# Altium schematic sheet 01_BLOCK_DIAGRAM.SchDoc: Block diagram
size 420 x 297 mm; Author: T. Ludemann; SheetNumber: 1; SheetTotal: 8; DocSize: DINA3
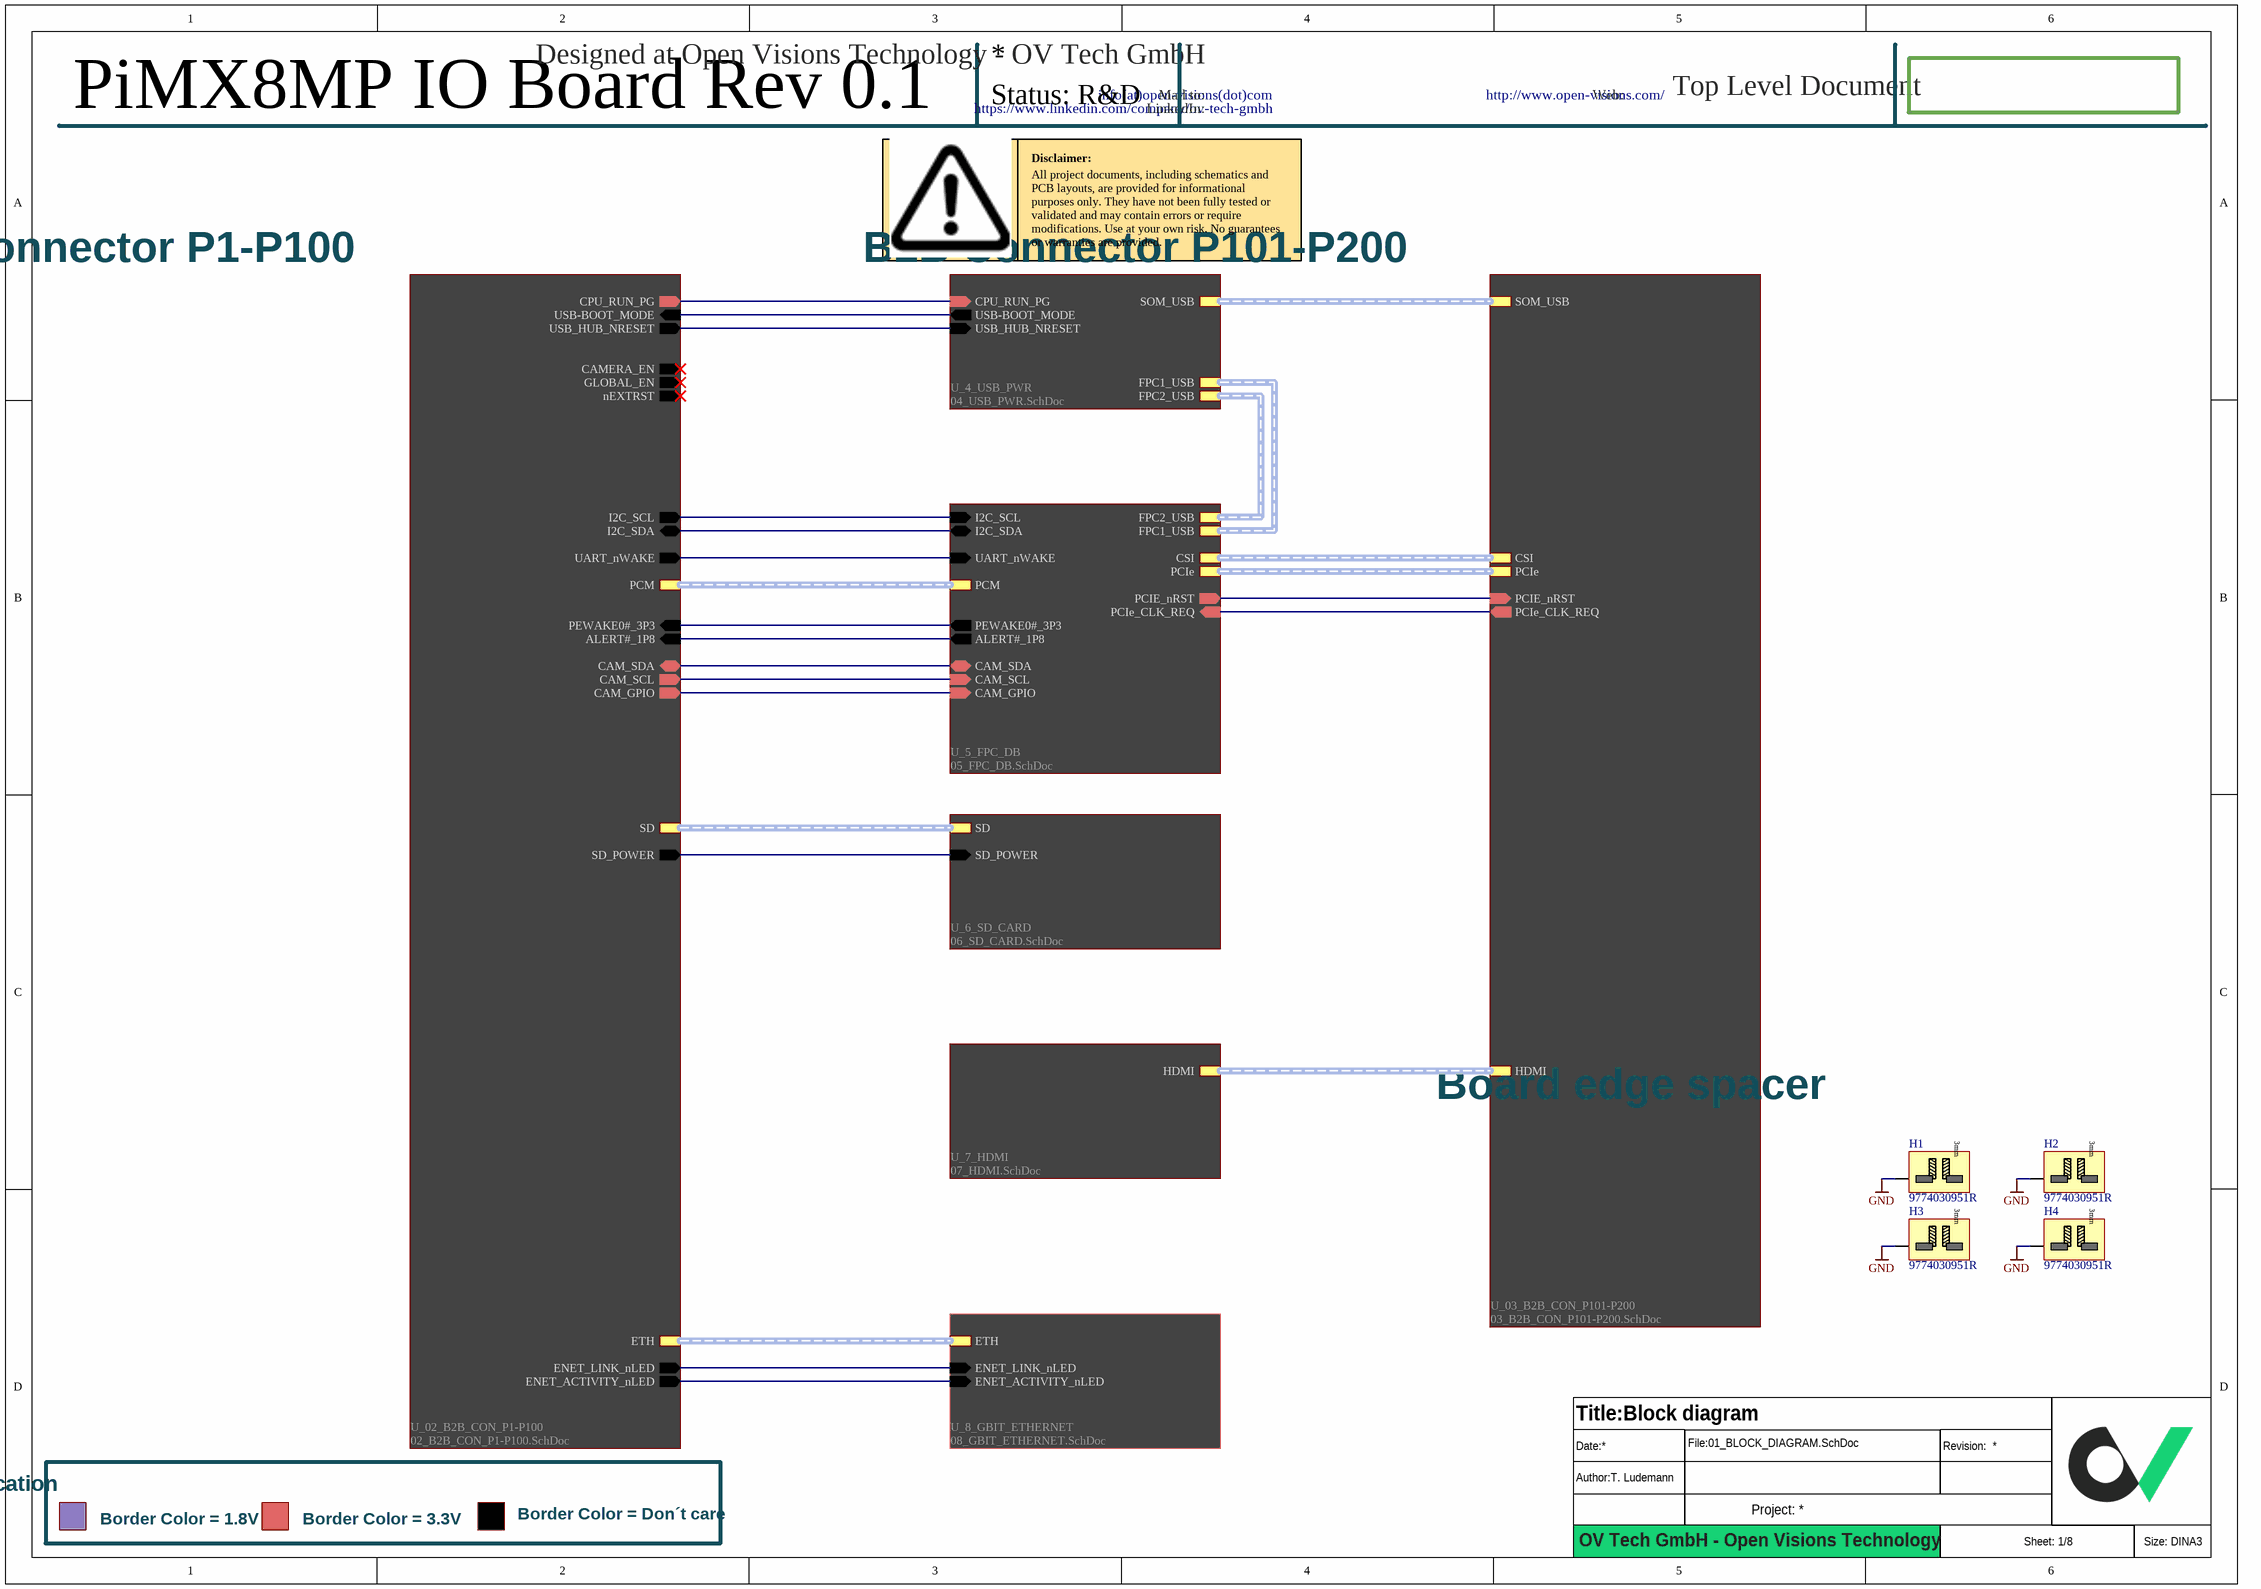
[diagram p0: 01_BLOCK_DIAGRAM.SchDoc]

## Parts
?  (no value)  (graphical)
H1  9774030951R  [Spacer_SMD_Ø2.7mmx3mm_9774030951]
H2  9774030951R  [Spacer_SMD_Ø2.7mmx3mm_9774030951]
H3  9774030951R  [Spacer_SMD_Ø2.7mmx3mm_9774030951]
H4  9774030951R  [Spacer_SMD_Ø2.7mmx3mm_9774030951]

## Sub-sheets
U_02_B2B_CON_P1-P100 = 02_B2B_CON_P1-P100.SchDoc: CPU_RUN_PG (out), USB-BOOT_MODE (in), USB_HUB_NRESET (out), SD (harness SD), SD_POWER (out), ETH (harness ETH), ENET_LINK_nLED (out), ENET_ACTIVITY_nLED (out), CAMERA_EN (out), GLOBAL_EN (out), nEXTRST (out), I2C_SCL (out), I2C_SDA (bidir), PEWAKE0#_3P3 (in), ALERT#_1P8 (in), UART_nWAKE (out), PCM (harness PCM), CAM_SDA (bidir), CAM_SCL (out), CAM_GPIO (out)
U_03_B2B_CON_P101-P200 = 03_B2B_CON_P101-P200.SchDoc: SOM_USB (harness SOM_USB), HDMI (harness HDMI), CSI (harness CSI), PCIe (harness PCIe), PCIE_nRST (in), PCIe_CLK_REQ (out)
U_4_USB_PWR = 04_USB_PWR.SchDoc: SOM_USB (harness SOM_USB), CPU_RUN_PG (in), USB-BOOT_MODE (out), USB_HUB_NRESET (in), FPC1_USB (harness FPC1_USB), FPC2_USB (harness FPC2_USB)
U_5_FPC_DB = 05_FPC_DB.SchDoc: CSI (harness CSI), PCIe (harness PCIe), FPC2_USB (harness FPC2_USB), FPC1_USB (harness FPC1_USB), PCIE_nRST (out), PCIe_CLK_REQ (in), I2C_SCL (in), I2C_SDA (bidir), PEWAKE0#_3P3 (out), ALERT#_1P8 (out), UART_nWAKE (in), PCM (harness PCM), CAM_SDA (bidir), CAM_SCL (in), CAM_GPIO (in)
U_6_SD_CARD = 06_SD_CARD.SchDoc: SD (harness SD), SD_POWER (in)
U_7_HDMI = 07_HDMI.SchDoc: HDMI (harness HDMI)
U_8_GBIT_ETHERNET = 08_GBIT_ETHERNET.SchDoc: ETH (harness ETH), ENET_LINK_nLED (in), ENET_ACTIVITY_nLED (in)

## Nets
GND: H1.MT H2.MT H3.MT H4.MT
(unnamed): sheet U_02_B2B_CON_P1-P100/CPU_RUN_PG, sheet U_4_USB_PWR/CPU_RUN_PG
(unnamed): sheet U_02_B2B_CON_P1-P100/USB-BOOT_MODE, sheet U_4_USB_PWR/USB-BOOT_MODE
(unnamed): sheet U_02_B2B_CON_P1-P100/USB_HUB_NRESET, sheet U_4_USB_PWR/USB_HUB_NRESET
(unnamed): sheet U_02_B2B_CON_P1-P100/SD_POWER, sheet U_6_SD_CARD/SD_POWER
(unnamed): sheet U_02_B2B_CON_P1-P100/ENET_LINK_nLED, sheet U_8_GBIT_ETHERNET/ENET_LINK_nLED
(unnamed): sheet U_02_B2B_CON_P1-P100/ENET_ACTIVITY_nLED, sheet U_8_GBIT_ETHERNET/ENET_ACTIVITY_nLED
(unnamed): sheet U_02_B2B_CON_P1-P100/I2C_SCL, sheet U_5_FPC_DB/I2C_SCL
(unnamed): sheet U_02_B2B_CON_P1-P100/I2C_SDA, sheet U_5_FPC_DB/I2C_SDA
(unnamed): sheet U_02_B2B_CON_P1-P100/PEWAKE0#_3P3, sheet U_5_FPC_DB/PEWAKE0#_3P3
(unnamed): sheet U_02_B2B_CON_P1-P100/ALERT#_1P8, sheet U_5_FPC_DB/ALERT#_1P8
(unnamed): sheet U_02_B2B_CON_P1-P100/UART_nWAKE, sheet U_5_FPC_DB/UART_nWAKE
(unnamed): sheet U_02_B2B_CON_P1-P100/CAM_SDA, sheet U_5_FPC_DB/CAM_SDA
(unnamed): sheet U_02_B2B_CON_P1-P100/CAM_SCL, sheet U_5_FPC_DB/CAM_SCL
(unnamed): sheet U_02_B2B_CON_P1-P100/CAM_GPIO, sheet U_5_FPC_DB/CAM_GPIO
(unnamed): sheet U_5_FPC_DB/PCIE_nRST, sheet U_03_B2B_CON_P101-P200/PCIE_nRST
(unnamed): sheet U_5_FPC_DB/PCIe_CLK_REQ, sheet U_03_B2B_CON_P101-P200/PCIe_CLK_REQ

## Buses and harness runs
harness sheet U_02_B2B_CON_P1-P100/ETH = sheet U_8_GBIT_ETHERNET/ETH
harness sheet U_02_B2B_CON_P1-P100/PCM = sheet U_5_FPC_DB/PCM
harness sheet U_02_B2B_CON_P1-P100/SD = sheet U_6_SD_CARD/SD
harness sheet U_03_B2B_CON_P101-P200/CSI = sheet U_5_FPC_DB/CSI
harness sheet U_03_B2B_CON_P101-P200/HDMI = sheet U_7_HDMI/HDMI
harness sheet U_03_B2B_CON_P101-P200/PCIe = sheet U_5_FPC_DB/PCIe
harness sheet U_03_B2B_CON_P101-P200/SOM_USB = sheet U_4_USB_PWR/SOM_USB
harness sheet U_4_USB_PWR/FPC1_USB = sheet U_5_FPC_DB/FPC1_USB
harness sheet U_4_USB_PWR/FPC2_USB = sheet U_5_FPC_DB/FPC2_USB

## Notes on the sheet
- PiMX8MP IO Board Rev 0.1
- Status: R&D
- Designed at Open Visions Technology - OV Tech GmbH
- Mail to:
- LinkedIn:
- info(at)open-visions(dot)com
- https://www.linkedin.com/company/ov-tech-gmbh
- Web:
- http://www.open-visions.com/
- Top Level Document
- Disclaimer:
- B2B Connector P1-P100
- All project documents, including schematics and PCB layouts, are provided for informational purposes only. They have not been fully tested or validated and may contain errors or require modifications. Use at your own risk. No guarantees or warranties are provided.
- B2B Connector P101-P200
- USB + Power
- FPC DB Connector
- SD Card
- HDMI
- Board edge spacer
- Gbit Ethernet
- Signal Level Indication
- Border Color = 1.8V
- Border Color = 3.3V
- Border Color = Don´t care
- OV Tech GmbH - Open Visions Technology
- (in symbol Spacer_SMD_Ø2.7mm_internal_3mm) 3mm

## Library data of the parts
? = Titleblock_01_OpenSource
H1-H4 = Spacer_SMD_Ø2.7mm_internal_3mm: Würth Elektronik SMD Spacer Ø2.7mm 3mm length; Manufacturer 1: Würth Elektronik; Manufacturer 1 Prt. Nr.: 9774030951R